# EAGLE design adns_9500_wrapper (EAGLE 5.06)
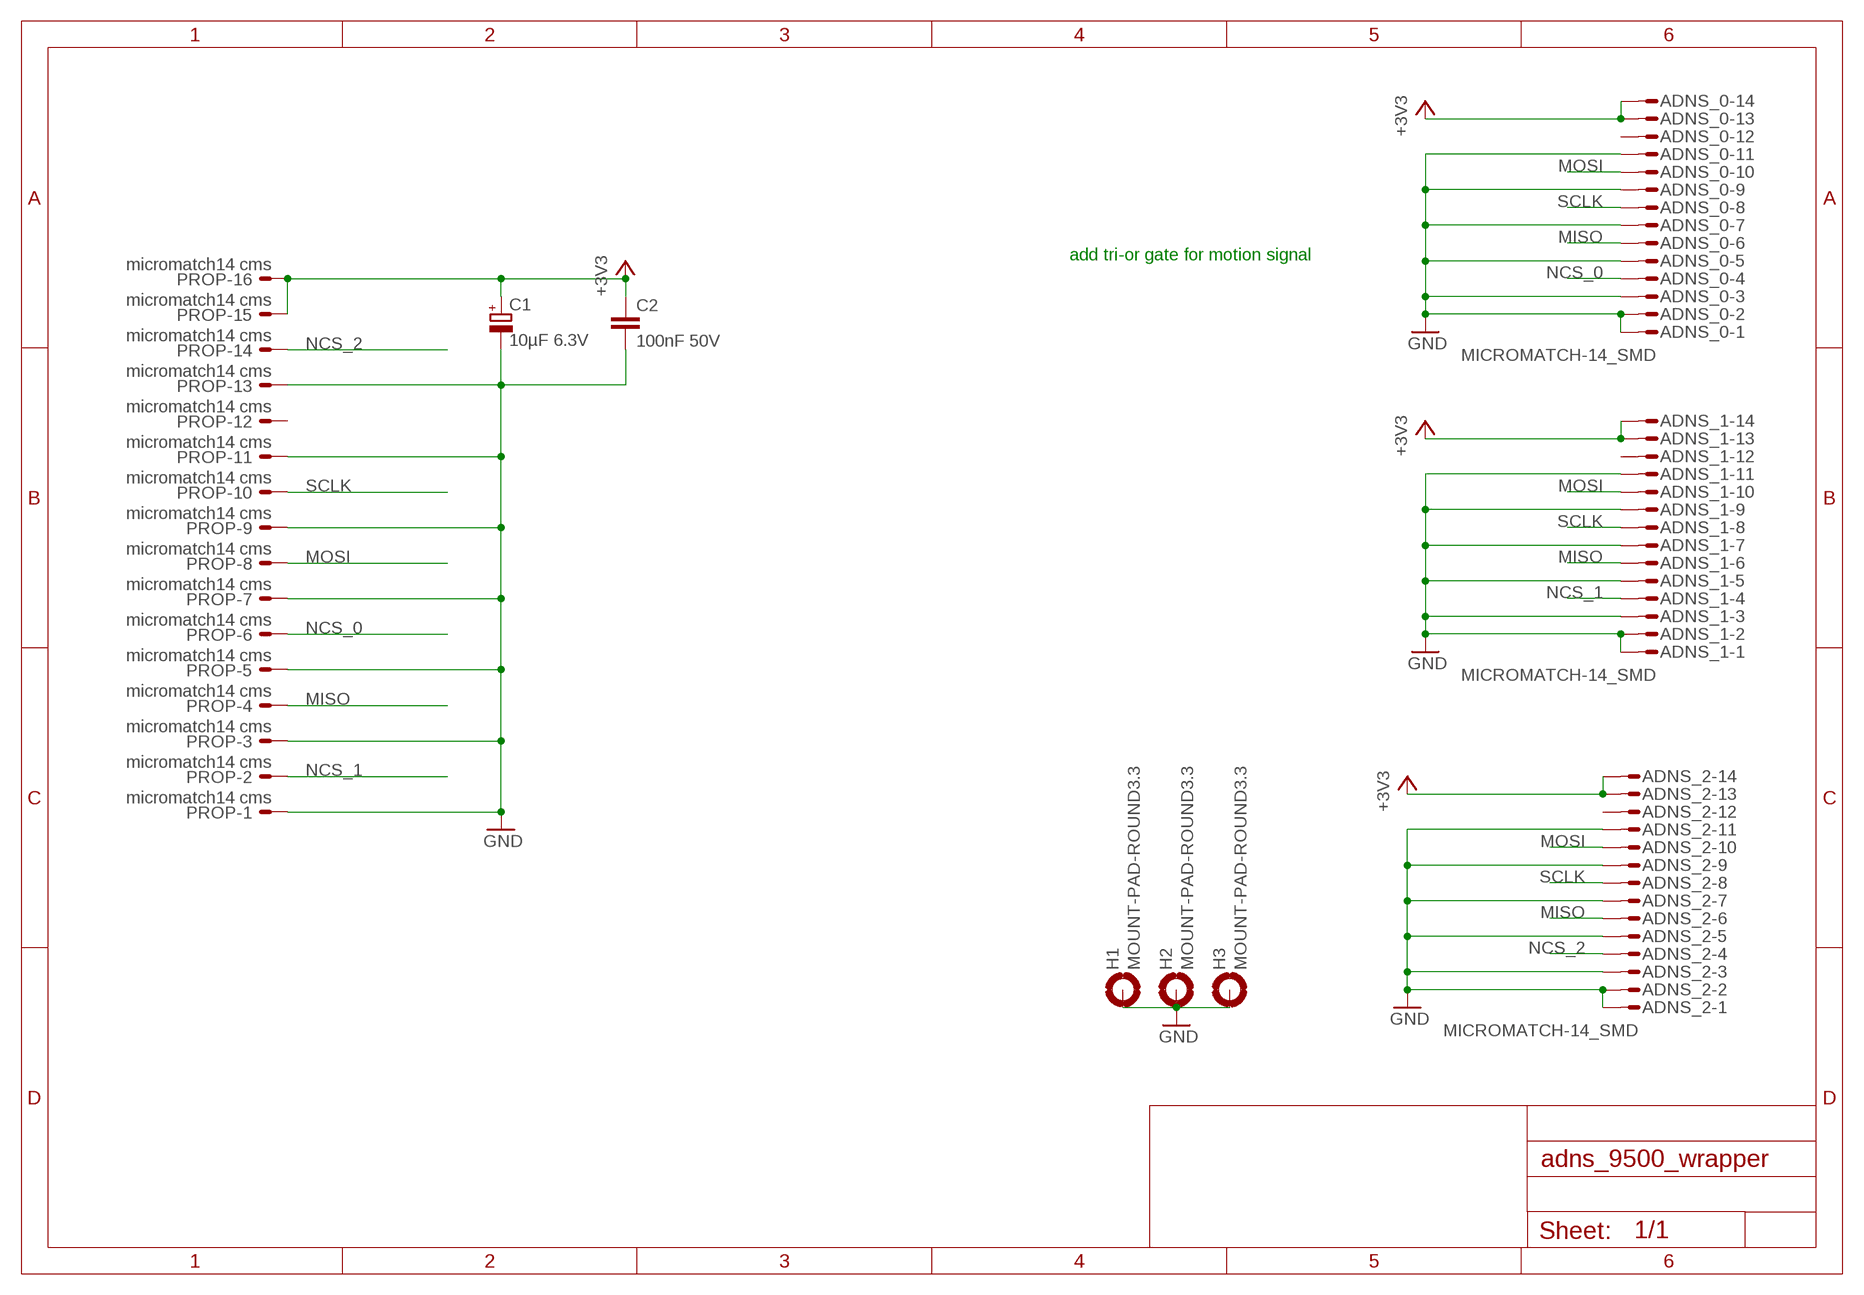
[diagram p0: schematic, sheet 1]

## Parts
ADNS_0  MICROMATCH-14_SMD  [MICROMATCH-14]
ADNS_1  MICROMATCH-14_SMD  [MICROMATCH-14]
ADNS_2  MICROMATCH-14_SMD  [MICROMATCH-14]
C1  10µF 6.3V  CPOL-EUSMCC  [SMC_C]
C2  100nF 50V  C-EUC0805  [C0805]
H1  MOUNT-PAD-ROUND3.3  [3,3-PAD]
H2  MOUNT-PAD-ROUND3.3  [3,3-PAD]
H3  MOUNT-PAD-ROUND3.3  [3,3-PAD]
PROP  micromatch14 cms  ML16E  [ML16]

## Nets
+3V3: ADNS_0.13 ADNS_0.14 ADNS_1.13 ADNS_1.14 ADNS_2.13 ADNS_2.14 C1.+ C2.1 PROP.15 PROP.16
GND: ADNS_0.1 ADNS_0.2 ADNS_0.3 ADNS_0.5 ADNS_0.7 ADNS_0.9 ADNS_0.11 ADNS_1.1 ADNS_1.2 ADNS_1.3 ADNS_1.5 ADNS_1.7 ADNS_1.9 ADNS_1.11 ADNS_2.1 ADNS_2.2 ADNS_2.3 ADNS_2.5 ADNS_2.7 ADNS_2.9 ADNS_2.11 C1.- C2.2 H1.B3,3(MOUNT) H2.B3,3(MOUNT) H3.B3,3(MOUNT) PROP.1 PROP.3 PROP.5 PROP.7 PROP.9 PROP.11 PROP.13
MISO: ADNS_0.6 ADNS_1.6 ADNS_2.6 PROP.4
MOSI: ADNS_0.10 ADNS_1.10 ADNS_2.10 PROP.8
NCS_0: ADNS_0.4 PROP.6
NCS_1: ADNS_1.4 PROP.2
NCS_2: ADNS_2.4 PROP.14
SCLK: ADNS_0.8 ADNS_1.8 ADNS_2.8 PROP.10
Unconnected: ADNS_0.12 ADNS_1.12 ADNS_2.12 PROP.12

## Notes on the sheet
- add tri-or gate for motion signal

## Library data of the parts
ADNS_0 ADNS_1 ADNS_2 = robotter:MICROMATCH-14_SMD: MicroMaTch 14 8-188275-4 / Drawing Number C-188275 DDEController.pdf
C1 = rcl:CPOL-EU: POLARIZED CAPACITOR, European symbol
C2 = rcl:C-EU: CAPACITOR, European symbol
H1-H3 = holes:MOUNT-PAD-ROUND: MOUNTING PAD, round
PROP = con-ml:ML16E: HARTING

## Board
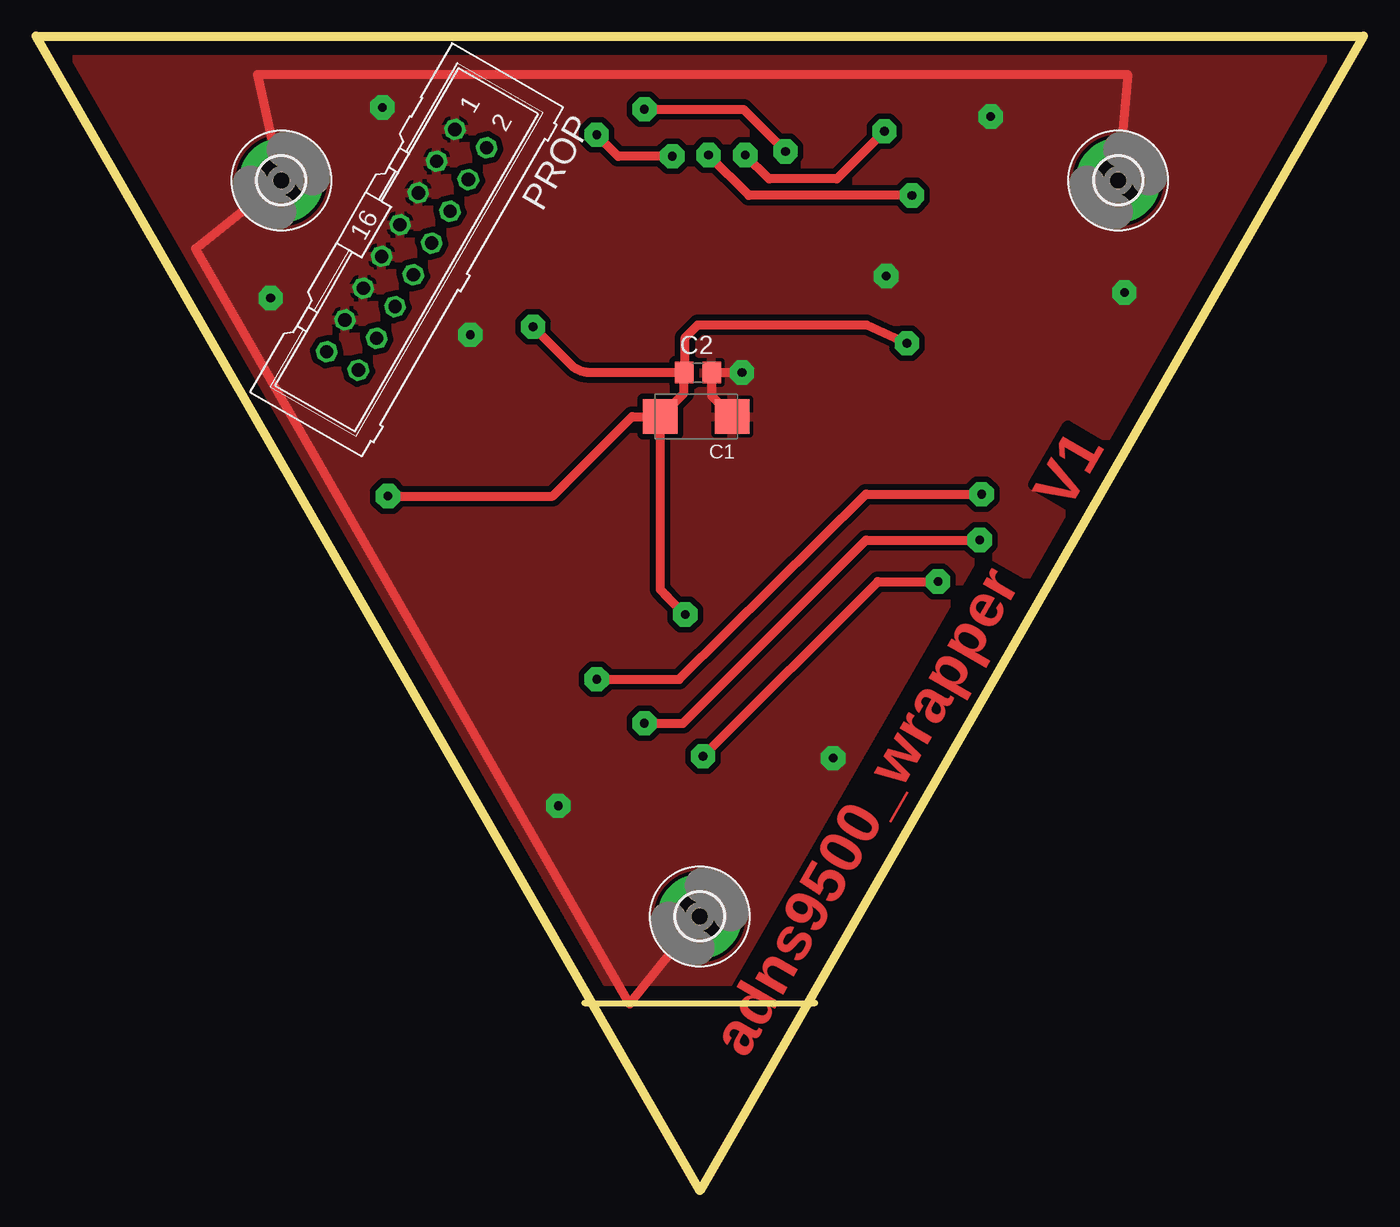
[diagram p1: board, top side]
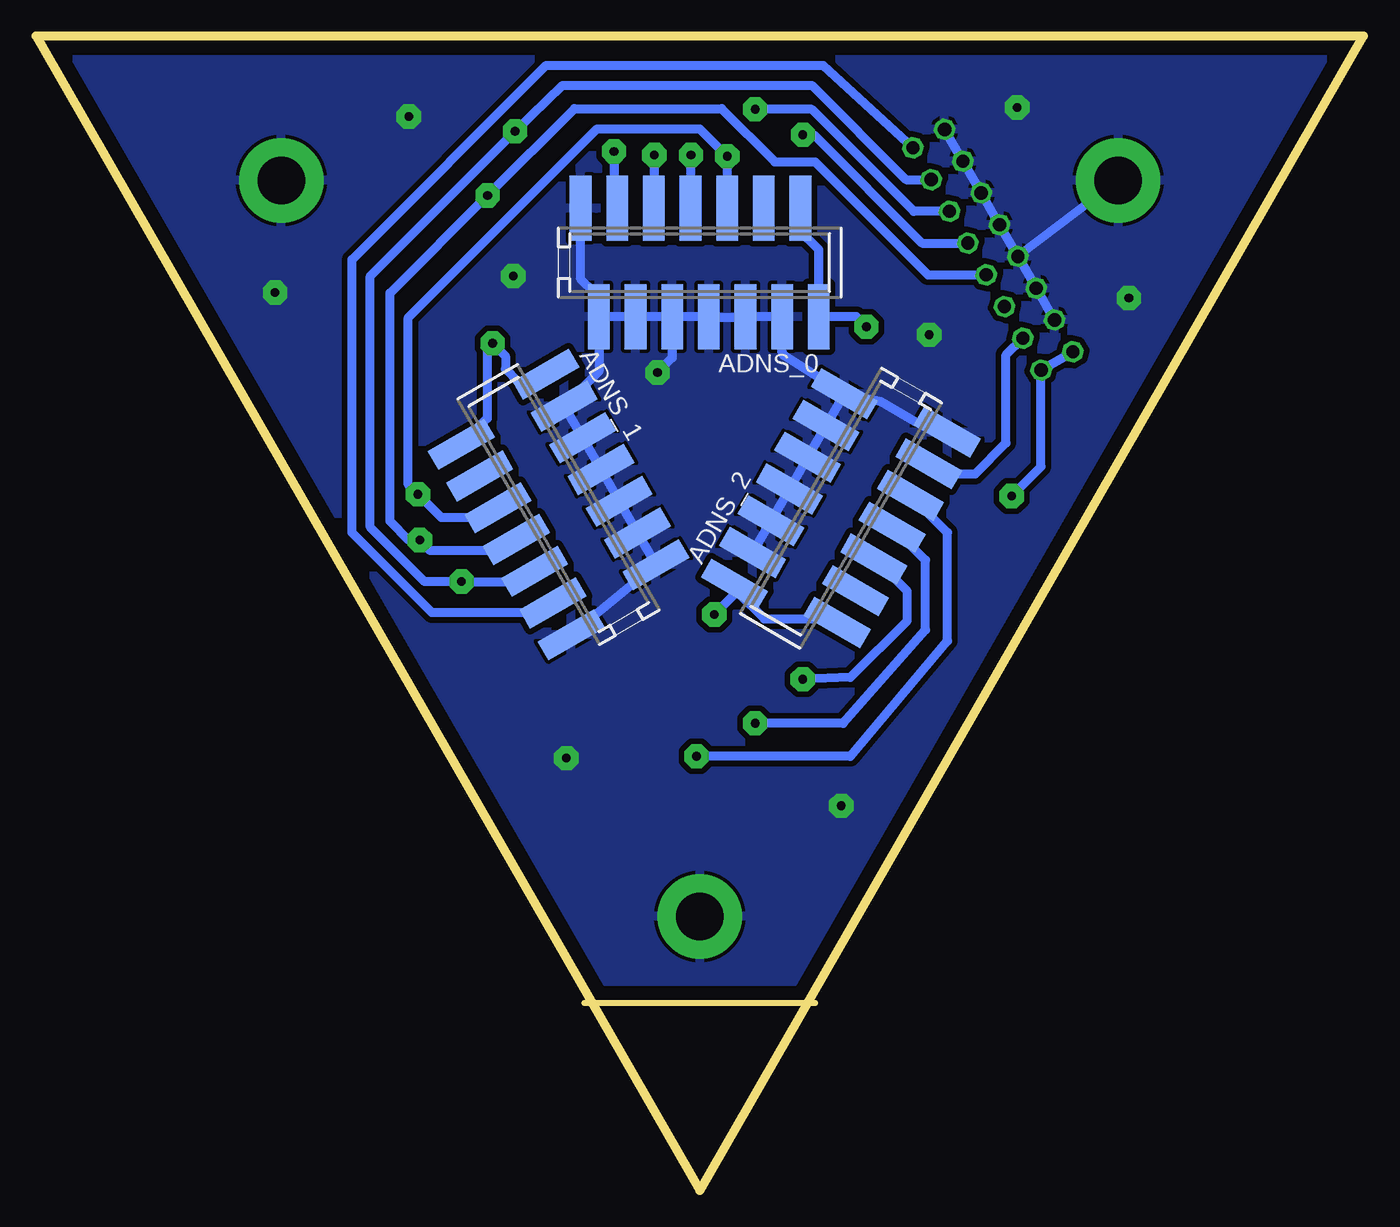
[diagram p2: board, bottom side, seen from below]

Size 92 x 80 mm. Coordinates in mm from the lower left corner, seen from the top.
Outline: 38,13 54,13
Outline: 0,80 92,80 46,0 0,80
Copper layers (1*16): Top 0.035mm / dielectric 1.5mm / Bottom 0.035mm
Design rules "default *": minimum track width 0.5mm, minimum drill 0.6mm, track to track 0.4mm, track to pad 0.4mm, pad to pad 0.4mm, via to via 0.4mm, smd to smd 8mil, copper to edge 1mm, drill to drill 8mil, minimum pad ring 10mil, minimum via ring 8mil, stop-mask expansion 4mil, vias tented up to drill 0mil, thermal gap 10mil

### Footprints (pad centres in the part's own frame; a part is rotated, then mirrored left to right if it is on the bottom)
MICROMATCH-14 = smd 1.5 x 4.5: 1 6.985,3.75; 2 8.255,-3.75; 3 4.445,3.75; 4 5.715,-3.75; 5 1.905,3.75; 6 3.175,-3.75; 7 -0.635,3.75; 8 0.635,-3.75; 9 -3.175,3.75; 10 -1.905,-3.75; 11 -5.715,3.75; 12 -4.445,-3.75; 13 -8.255,3.75; 14 -6.985,-3.75
SMC_C = smd 2.4 x 2.4: + -2.5,0; - 2.5,0
C0805 = smd 1.3 x 1.5: 1 -0.95,0; 2 0.95,0
3,3-PAD = drill 3.3 pad 5.842 round: B3,3 0,0
ML16 = drill 0.914 octagon: 1 -8.89,-1.27; 2 -8.89,1.27; 3 -6.35,-1.27; 4 -6.35,1.27; 5 -3.81,-1.27; 6 -3.81,1.27; 7 -1.27,-1.27; 8 -1.27,1.27; 9 1.27,-1.27; 10 1.27,1.27; 11 3.81,-1.27; 12 3.81,1.27; 13 6.35,-1.27; 14 6.35,1.27; 15 8.89,-1.27; 16 8.89,1.27

### Placement (x,y rotation side)
ADNS_0  46.01,64.31 180 bottom
ADNS_1  55.78,47.54 300 bottom
ADNS_2  36.23,47.29 60 bottom
C1  45.75,53.64 0 top
C2  45.88,56.69 0 top
H1  46,19 0 top
H2  17,70 0 top
H3  75,70 0 top
PROP  25.68,65.2 240 top

### Tracks (layer width: path | path; a pad name or v marks a point on that pad's centre or on a via)
+3V3  (via drill 0.6 pad 1.68)
  Top 0.61: 43.78,41.13 v44.99,39.92 | 43.78,41.13 43.63,41.28 | C1.+ 44.9,55.27 C2.1 | v34.45,59.86 37.12,57.19 arc45 38.33,56.69 C2.1 | C2.1 44.99,56.75 44.99,59.1 45.88,59.99 57.56,59.99 v60.36,58.72 | C1.+ 43.25,41.66 43.78,41.13 | C1.+ 43.2,53.59 | v24.38,48.13 35.81,48.13 41.32,53.64 C1.+
  Bottom 0.61: ADNS_0.14 39.15,67.93 39.15,66.59 37.75,65.2 ADNS_0.13 35.14,60.56 v34.45,59.86 | v44.99,39.92 43.6,41.31 ADNS_2.13 43.47,41.89 43.35,41.44 41.53,39.62 36.73,39.62 ADNS_2.14 | ADNS_1.13 57.55,56.57 58.07,56.05 58.58,56.05 59.47,56.94 59.47,57.83 v60.36,58.72 60.74,58.34 60.74,53.51 ADNS_1.14 | PROP.15 PROP.16 22.34,50.18 v24.38,48.13
GND  (via drill 0.6 pad 1.68)
  Top 0.61: C1.- 46.83,55.06 C2.2 v48.93,56.69 | H3.B3,3 75.66,77.34 15.34,77.34 H2.B3,3 11.05,65.28 41.15,12.95 H1.B3,3
  Bottom 0.61: ADNS_0.5 ADNS_0.7 45.82,60.56 45.88,60.5 42.89,60.5 ADNS_0.9 ADNS_0.11 40.29,58.13 arc-58 40.14,57.86 ADNS_2.1 | ADNS_0.5 ADNS_0.3 50.51,60.5 50.58,60.5 50.64,60.56 ADNS_0.1 | ADNS_0.1 53.06,60.62 53.12,60.62 53.12,62.15 53.24,62.28 53.37,62.28 54.26,63.16 ADNS_0.2 | ADNS_2.1 33.43,54.66 31.02,53.26 ADNS_2.2 | ADNS_1.2 ADNS_1.1 ADNS_1.3 ADNS_1.5 ADNS_1.7 ADNS_1.9 ADNS_1.11 52.99,56.77 ADNS_0.1 | v48.93,56.69 47.91,57.7 ADNS_0.5 | PROP.1 PROP.3 PROP.5 PROP.7 PROP.9 | PROP.9 PROP.11 21.51,60.46 PROP.13 | H2.B3,3 PROP.9 | ADNS_2.11 ADNS_2.9 ADNS_2.7 ADNS_2.5 ADNS_2.3 ADNS_2.1
  other vias: 24,75.06 16.26,61.85 30.1,59.31 36.2,26.67 55.24,29.97 58.93,63.37 66.17,74.42 75.44,62.23
  pour Bottom: 0,80 92,80 46,0
  pour Top: 0,80 92,80 46,0
MISO  (via drill 0.6 pad 1.68)
  Top 0.61: v49.15,71.75 50.8,70.1 55.5,70.1 v58.8,73.41 | v62.52,42.21 58.34,42.21 v46.23,30.1
  Bottom 0.61: ADNS_1.6 58.06,42.3 arc45 58.28,42.21 v62.52,42.21 65.07,42.21 68.83,45.97 68.83,63.37 v58.8,73.41 55.5,76.58 38.23,76.58 31.71,70.06 PROP.4 | ADNS_2.6 28.83,45.6 28.83,38.1 35.56,30.1 v46.23,30.1 | ADNS_0.6 49.18,71.72 v49.15,71.75
MOSI  (via drill 0.6 pad 1.68)
  Top 0.61: v65.53,48.26 57.53,48.26 44.58,35.43 v38.86,35.43 | v44.1,71.67 40.34,71.67 v38.85,73.16
  Bottom 0.61: ADNS_1.10 60.65,46.66 63.93,46.66 v65.53,48.26 66.2,48.93 66.2,60.5 53.12,73.58 46.01,73.58 v44.1,71.67 ADNS_0.10 | ADNS_2.10 33.86,43.77 31.62,41.53 31.62,39.5 35.56,35.56 v38.86,35.43 | v38.85,73.16 38.09,73.16 30.59,65.66 PROP.8
NCS_0  (via drill 0.6 pad 1.68)
  Top 0.61: v42.16,74.93 49.02,74.93 v51.94,72.01
  Bottom 0.61: v42.16,74.93 38.23,74.93 31.16,67.86 PROP.6 | v51.94,72.01 51.94,68.28 ADNS_0.4
NCS_1
  Bottom 0.61: ADNS_1.4 56.84,40.05 61.59,40.05 | 61.59,40.05 62.01,40.05 | PROP.2 37.45,77.98 56.64,77.98 70.1,64.52 70.1,45.59 64.56,40.05 61.59,40.05
NCS_2
  Bottom 0.61: ADNS_2.4 29.41,49.66 26.92,49.66 24.77,51.82 24.77,57.91 PROP.14
SCLK  (via drill 0.6 pad 1.68)
  Top 0.61: v46.61,71.75 49.4,68.96 v60.71,68.96 | v42.16,32.38 44.83,32.38 57.53,45.09 v65.41,45.09
  Bottom 0.61: ADNS_1.8 59.46,44.37 64.69,44.37 v65.41,45.09 66.17,45.09 67.47,46.39 67.47,62.2 v60.71,68.96 54.69,74.98 44.48,74.98 40.8,71.29 38,71.29 30.17,63.46 PROP.10 | ADNS_2.8 32.38,45.69 32.38,45.59 32.26,45.72 32,45.72 32.13,45.59 32.26,45.59 30.35,43.69 30.35,38.86 36.07,32.38 v42.16,32.38 | ADNS_0.8 46.64,71.75 v46.61,71.75

### Text on the board
Top: V1 | adns9500_wrapper